# EasyEDA schematic SCH_updated.json

## Sheets
1 Sheet_1: TITLE: PCB Design; REV: 1.0; Date: 2022-05-17; Sheet: 1/1; Company: SIT210
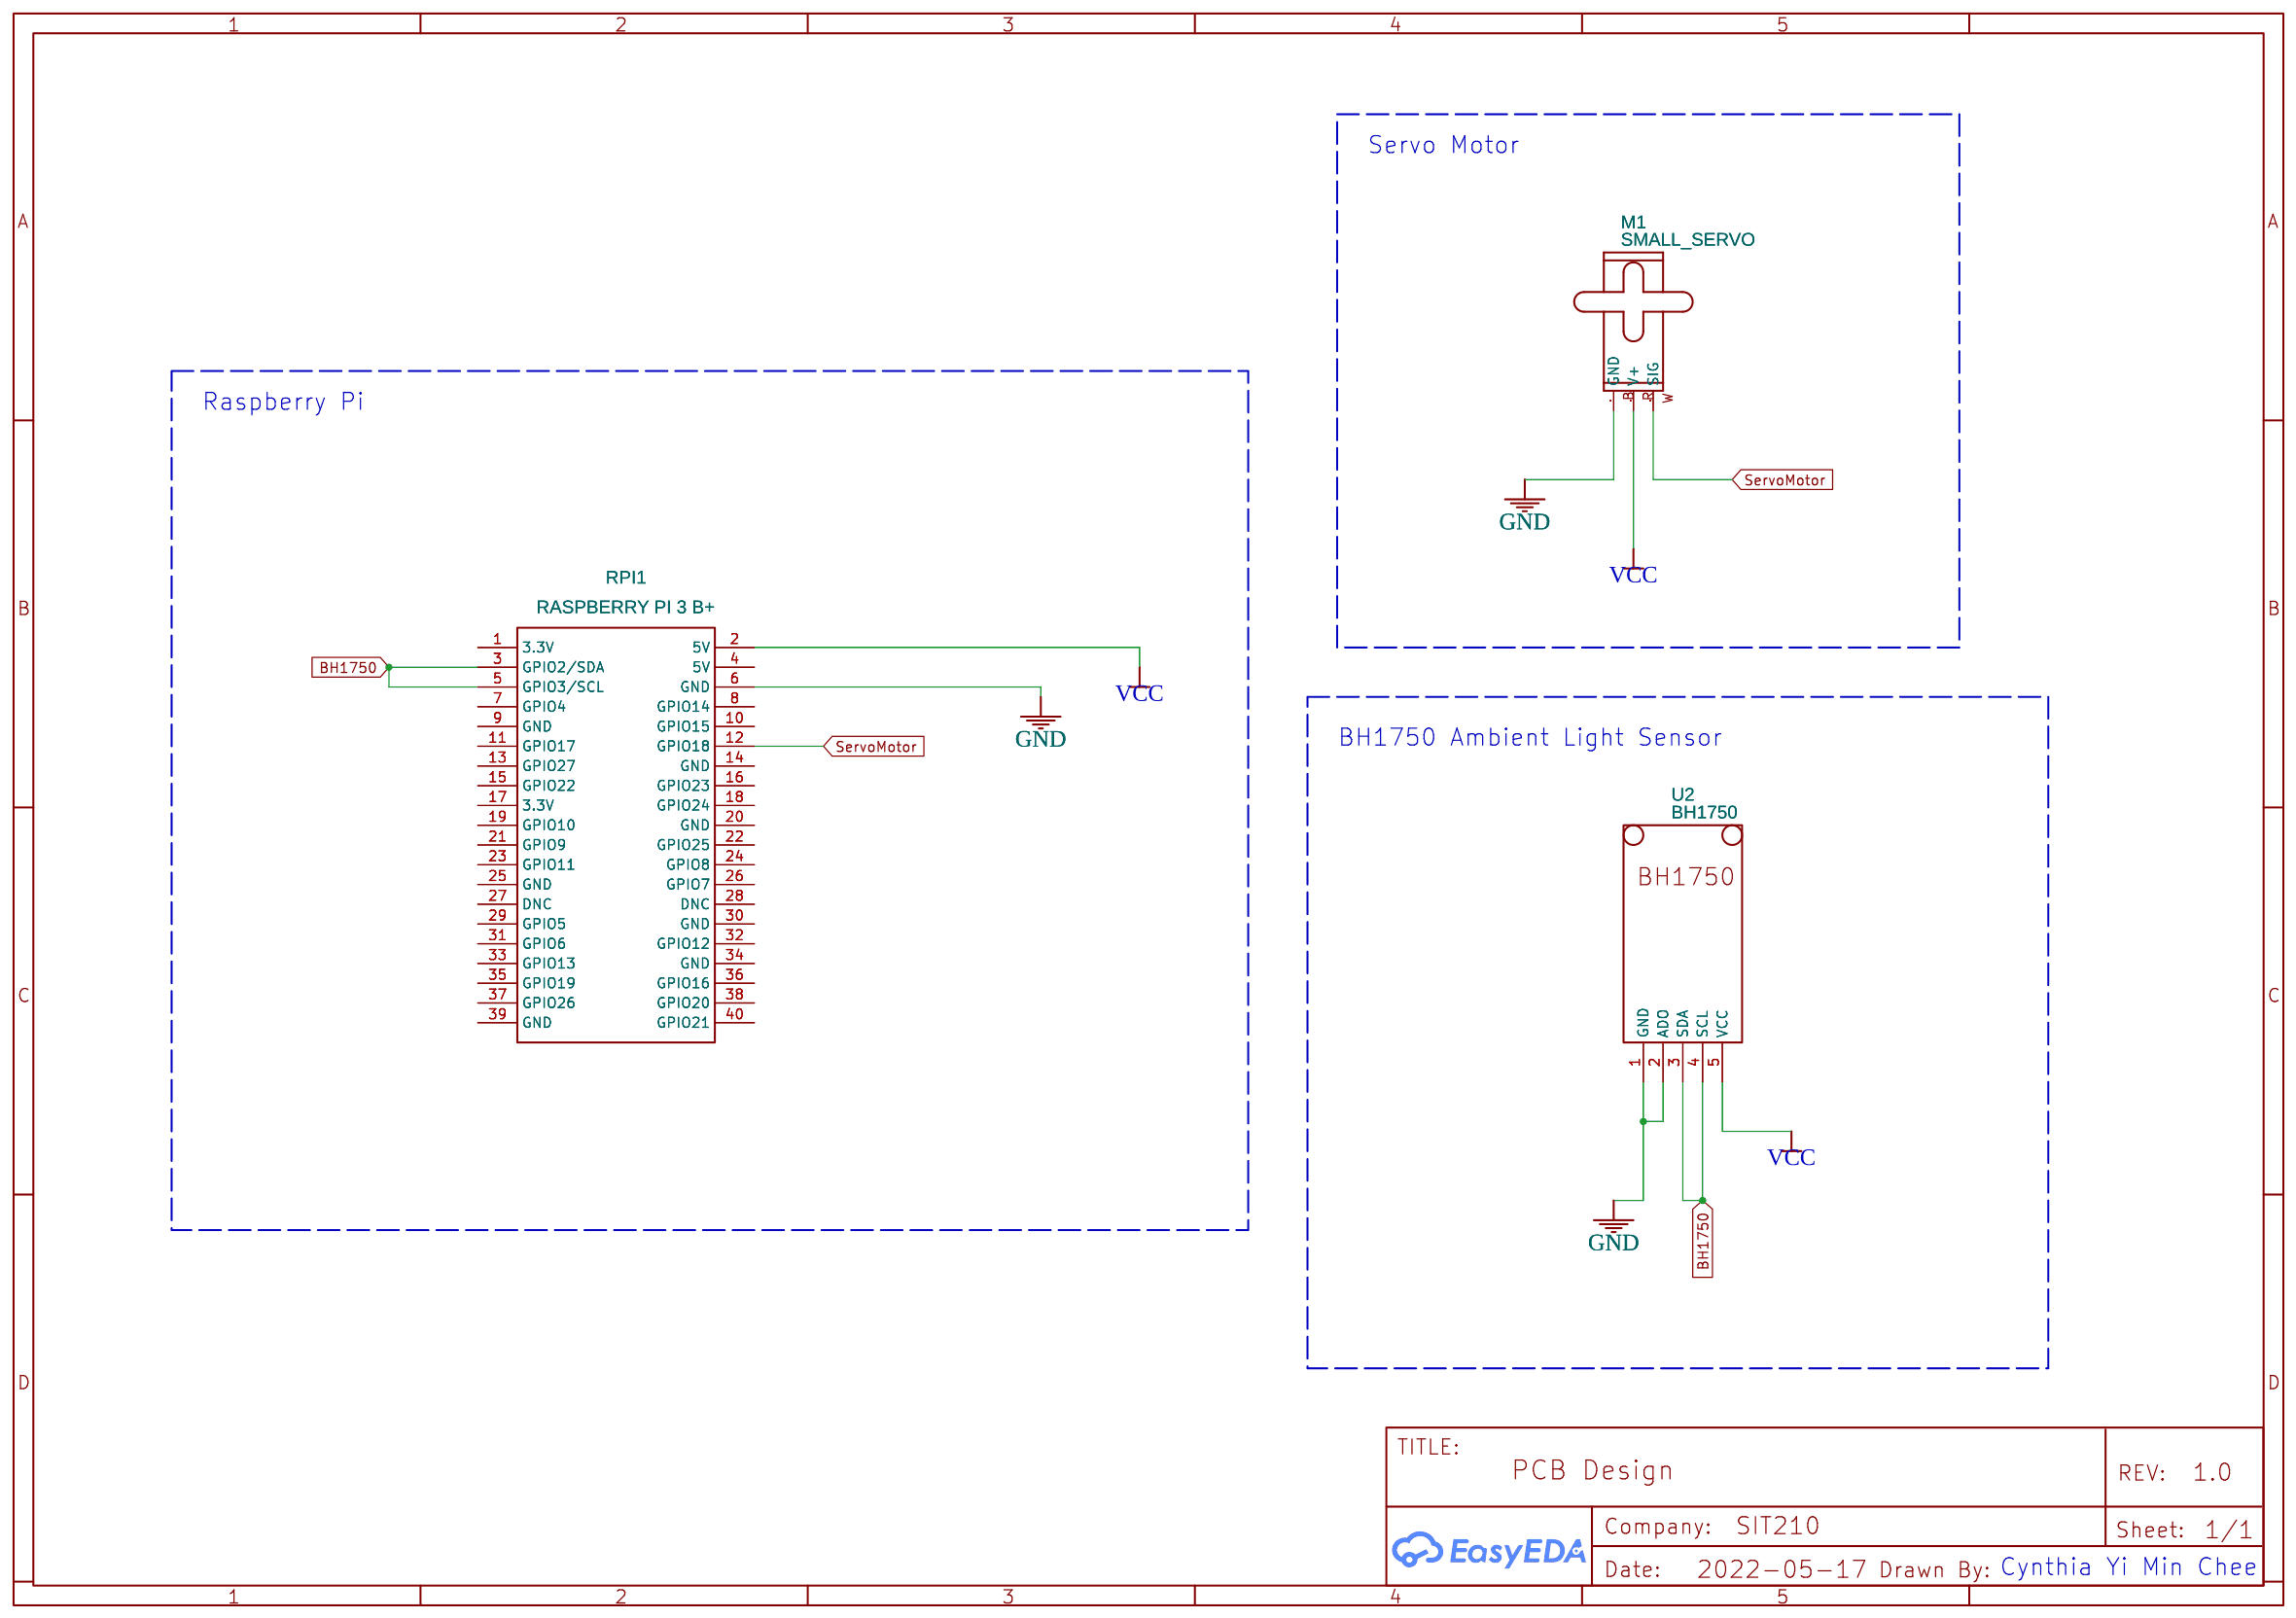
[diagram p0: Sheet_1]
2 Sheet_2
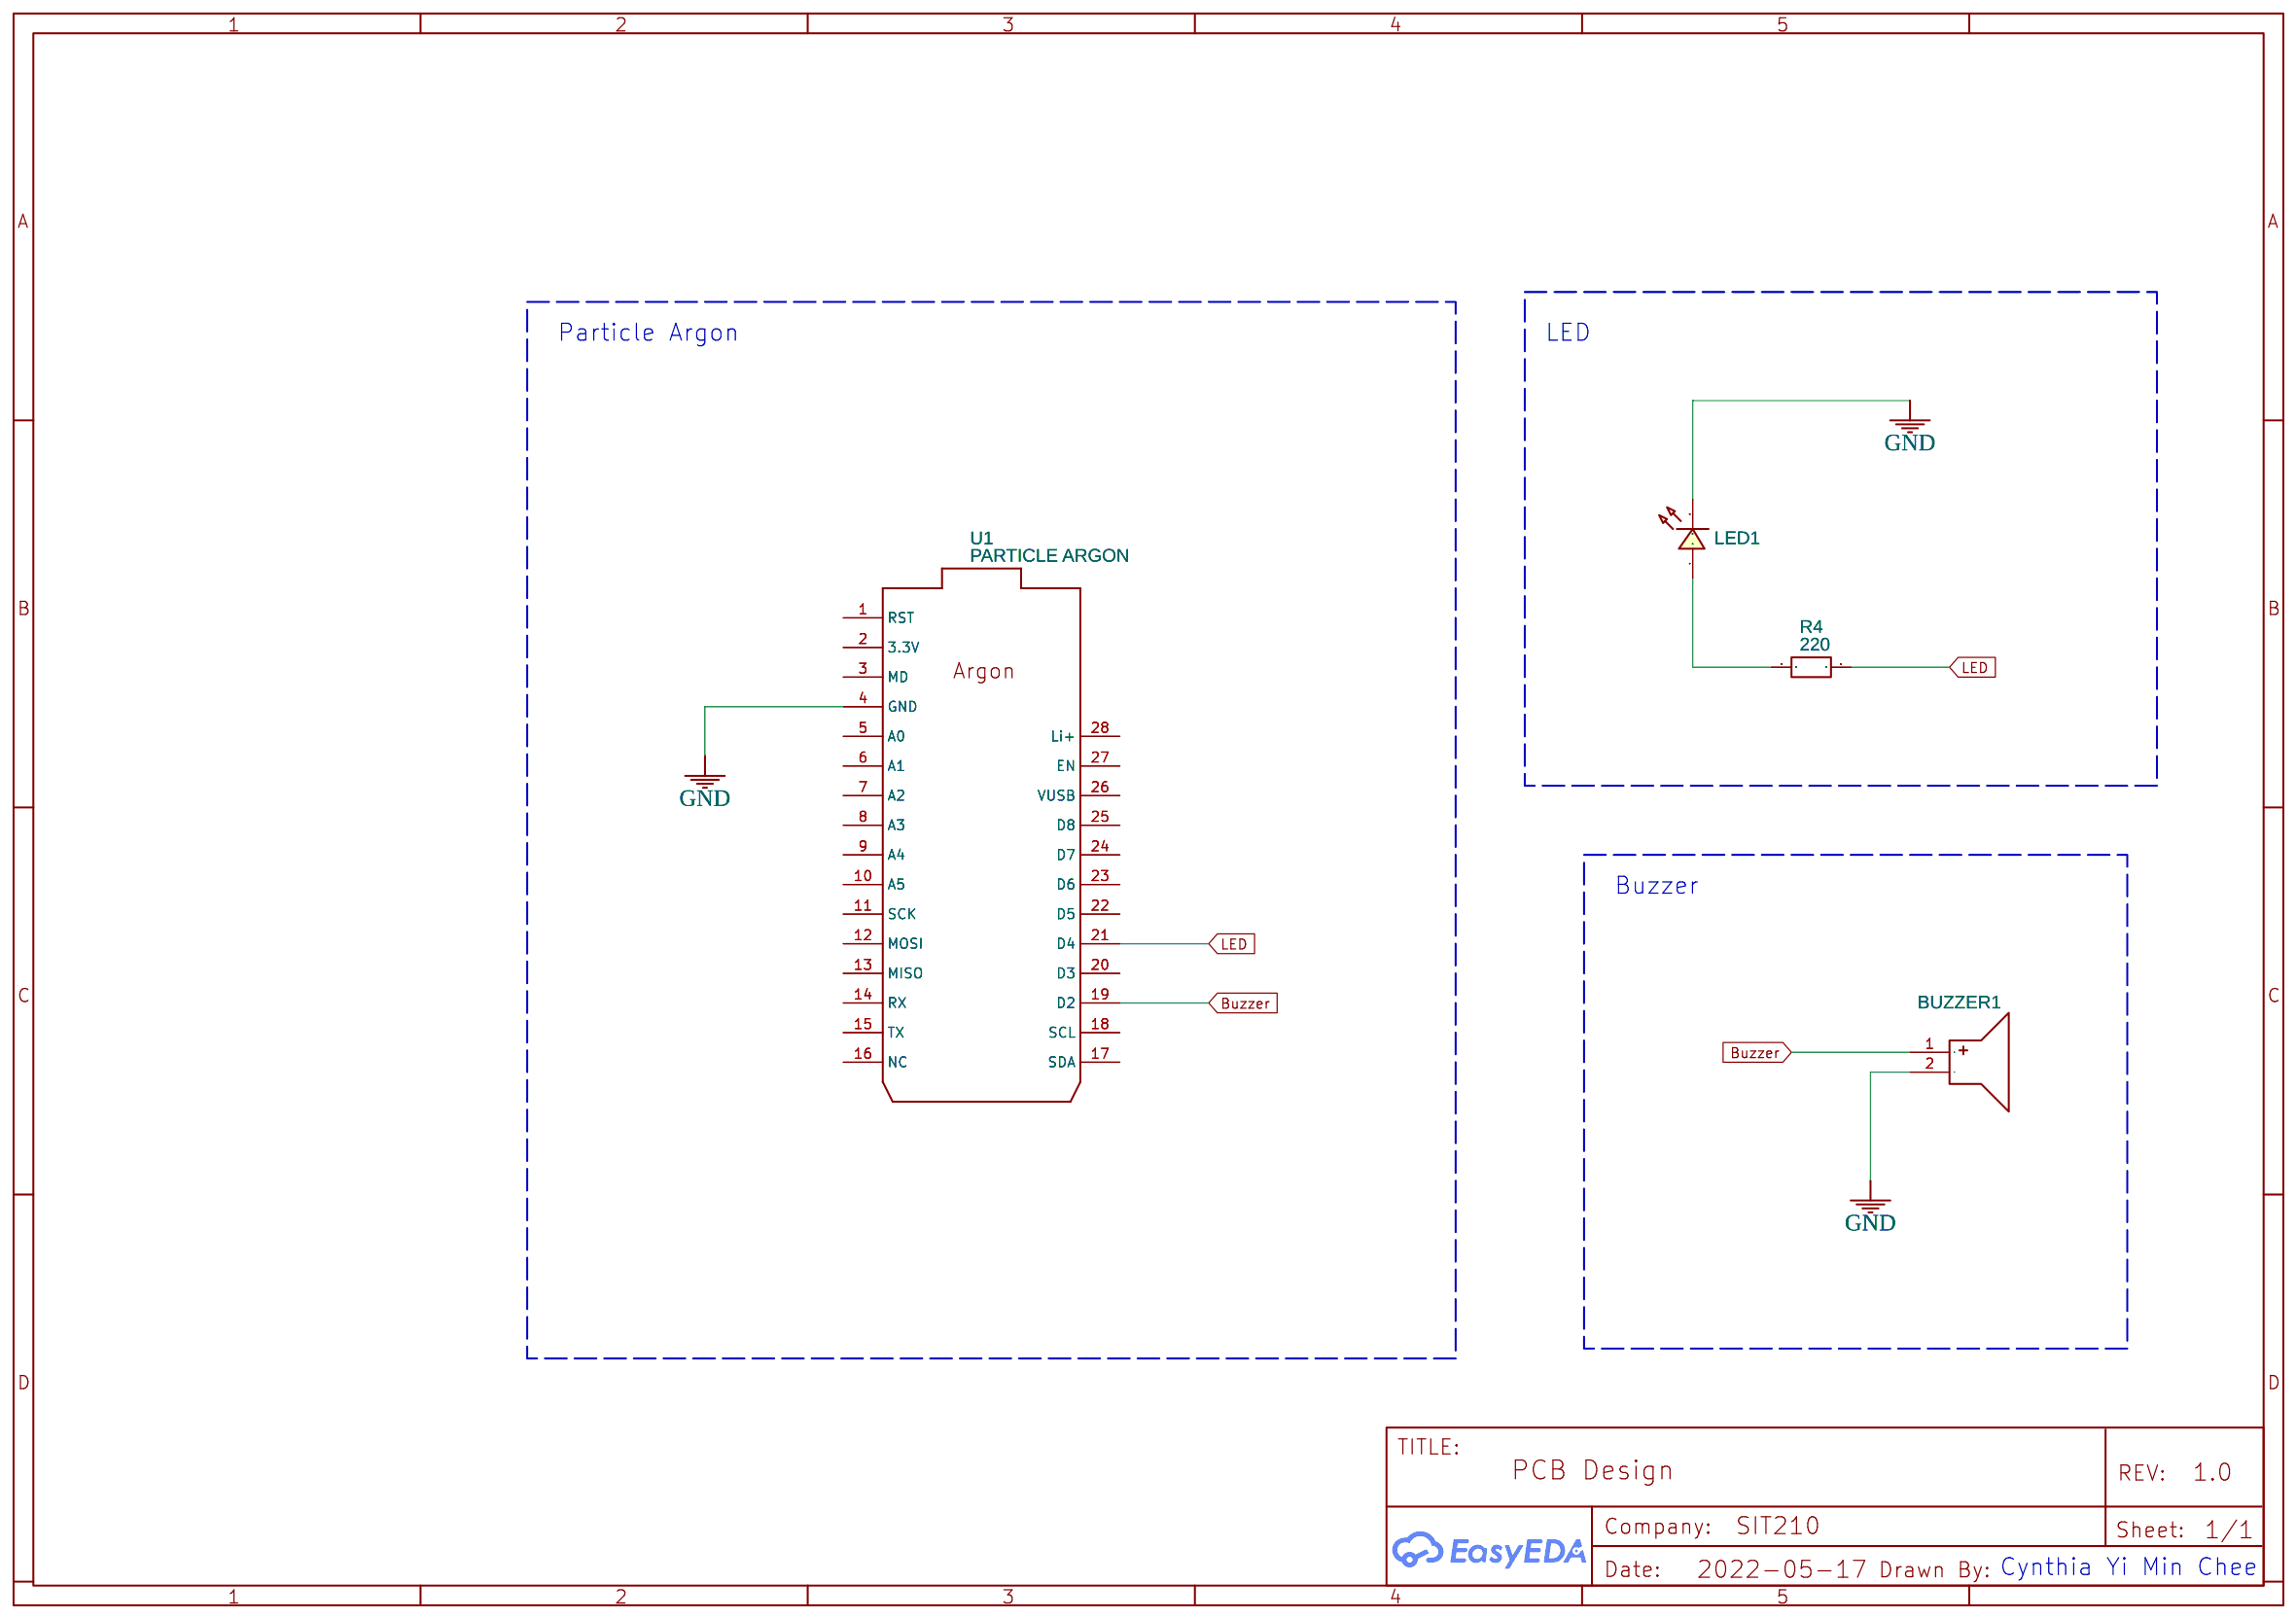
[diagram p1: Sheet_2]

## Parts
sheet Sheet_1
M1  SMALL_SERVO  [1X03]
RPI1  RASPBERRY PI 3 B+  [HDR-20X2/2.54]
U2  BH1750  [BH1750]
sheet Sheet_2
BUZZER1  BUZZER.9032  [BUZ-SMD_2P-L10.5-W9.0-P10.50-R]
LED1  LED-0603_R  [LED0603_RED]
R4  220  [R0603]
U1  PARTICLE ARGON  [PARTICLE ARGON]

## Library data of the parts
M1 = SMALL_SERVO: Small servo motor; Contributor: SparkFun
RPI1 = RASPBERRY PI 3 B+: Contributor: Sases; Supplier: Adafruit; Manufacturer: Raspberry Pi; Supplier Part: 3775; Manufacturer Part: Raspberry Pi 3 - Model B+ - 1.4GHz Cortex-A53 with 1GB RAM
U2 = BH1750: Supplier: RS-Online; Contributor: ndamo
BUZZER1 = BUZZER.9032: Supplier: LCSC; Supplier Part: C9900002564; Contributor: LCSC; JLCPCB Part Class: Extended Part
LED1 = LED-0603_R: Manufacturer: EVERLIGHT(台湾亿光); Manufacturer Part: 19-217/R6C-AL1M2VY/3T; Supplier Part: C72044; Supplier: LCSC; Contributor: LCEDA_01
R4 = R_0603_EU: Contributor: LCEDA_Lib
U1 = PARTICLE ARGON: Manufacturer: Particle; Manufacturer Part: Particle Argon; Supplier Part: Particle Argon; Supplier: Particle; Contributor: stevecoster

## Nets
GND: BUZZER1.2(-) LED1.2 M1.3(GND) RPI1.6(GND) U1.4(GND) U2.1(GND) U2.2(ADO)
VCC: M1.2(V+) RPI1.2(5V) U2.5(VCC)
BH1750: RPI1.3(GPIO2/SDA) RPI1.5(GPIO3/SCL) U2.3(SDA) U2.4(SCL)
Buzzer: BUZZER1.1(+) U1.19(D2)
LED: R4.1 U1.21(D4)
ServoMotor: M1.1(SIG) RPI1.12(GPIO18)
Net-(LED1-1): LED1.1 R4.2

Not connected (* = marked no-connect by the designer): RPI1 1(3.3V) 4(5V) 7(GPIO4) 8(GPIO14) 9(GND) 10(GPIO15) 11(GPIO17) 13(GPIO27) 14(GND) 15(GPIO22) 16(GPIO23) 17(3.3V) 18(GPIO24) 19(GPIO10) 20(GND) 21(GPIO9) 22(GPIO25) 23(GPIO11) 24(GPIO8) 25(GND) 26(GPIO7) 27(DNC) 28(DNC) 29(GPIO5) 30(GND) 31(GPIO6) 32(GPIO12) 33(GPIO13) 34(GND) 35(GPIO19) 36(GPIO16) 37(GPIO26) 38(GPIO20) 39(GND) 40(GPIO21); U1 1(RST) 2(3.3V) 3(MD) 5(A0) 6(A1) 7(A2) 8(A3) 9(A4) 10(A5) 11(SCK) 12(MOSI) 13(MISO) 14(RX) 15(TX) 16(NC) 17(SDA) 18(SCL) 20(D3) 22(D5) 23(D6) 24(D7) 25(D8) 26(VUSB) 27(EN) 28(Li+)

## Notes on the sheets
sheet 1
- Servo Motor
- Raspberry Pi
- BH1750 Ambient Light Sensor
- Cynthia Yi Min Chee
sheet 2
- Particle Argon
- LED
- Buzzer
- Cynthia Yi Min Chee
